# Altium schematic sheet 0071_HSIO MUXING -2.SchDoc
size 848 x 558 mm
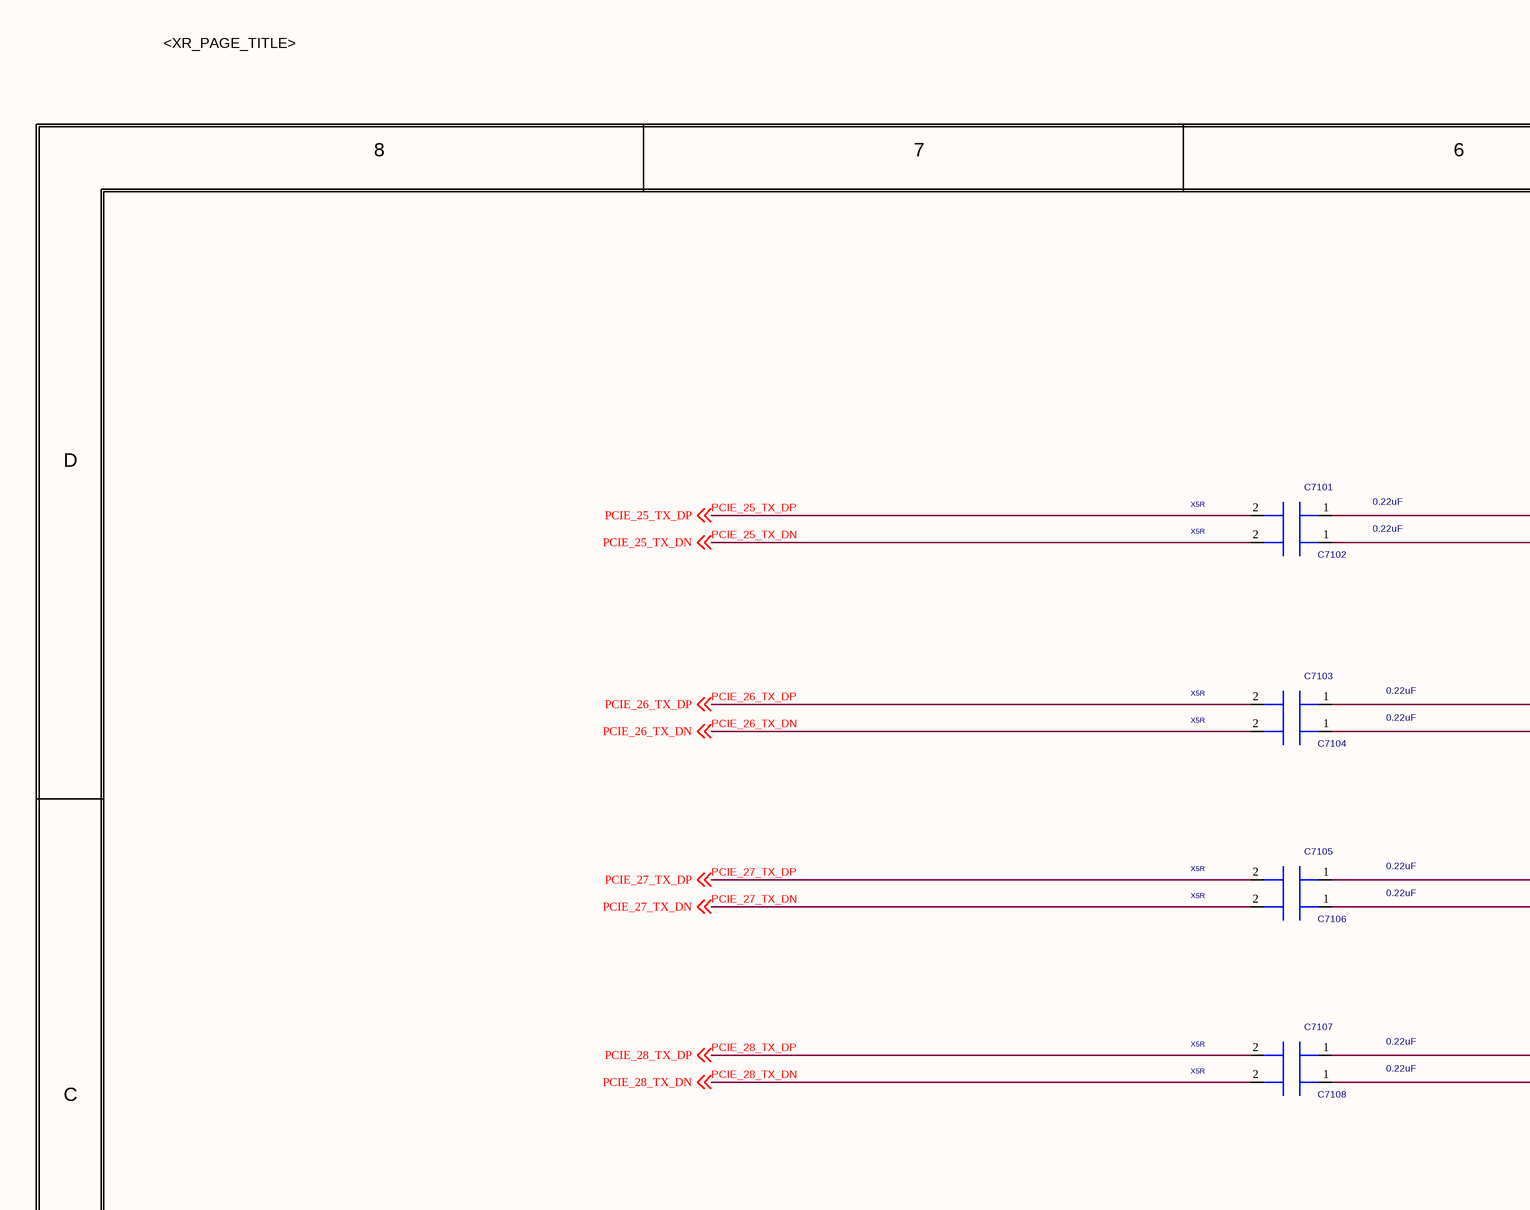
[diagram p0: 0071_HSIO MUXING -2.SchDoc, top left]
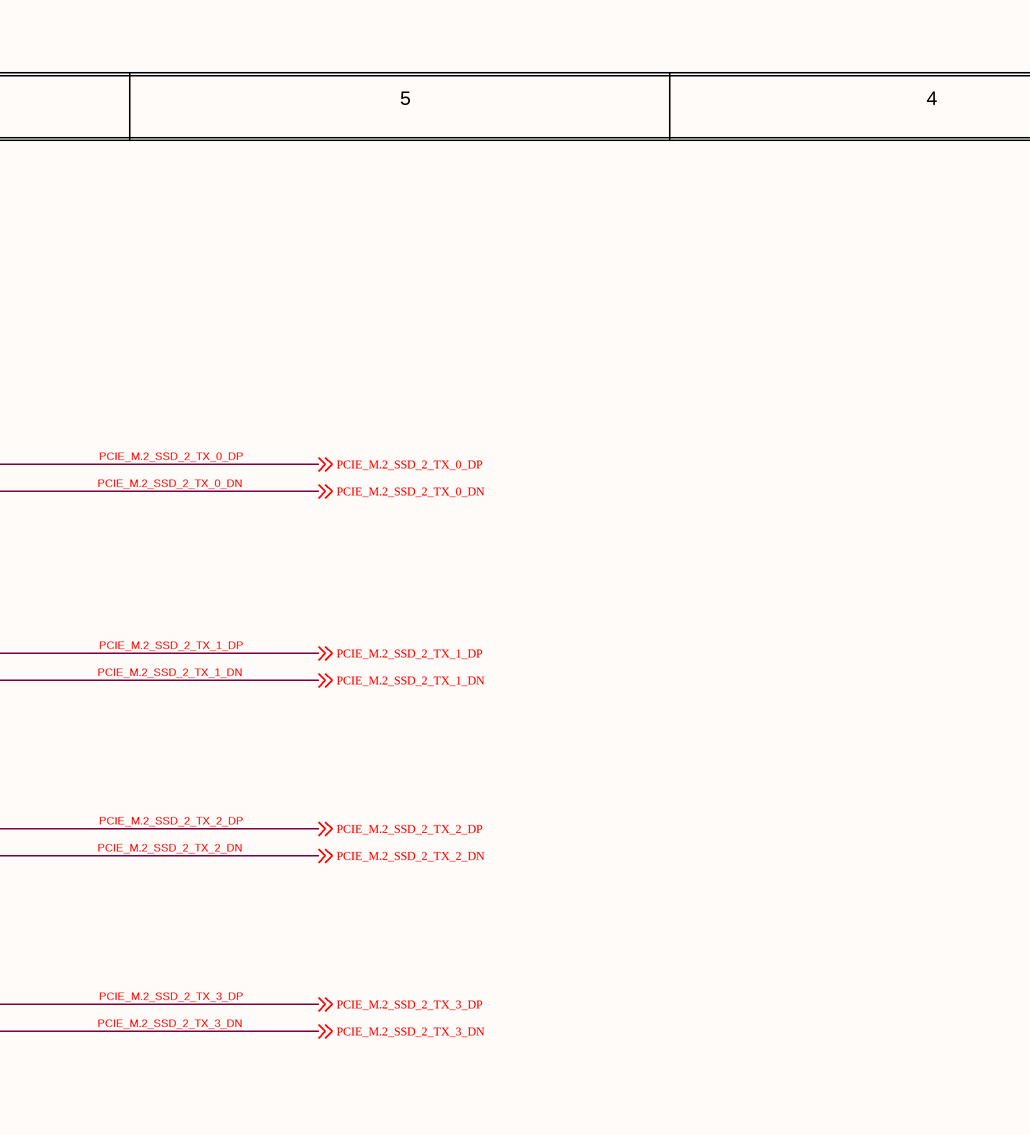
[diagram p1: 0071_HSIO MUXING -2.SchDoc, top middle]
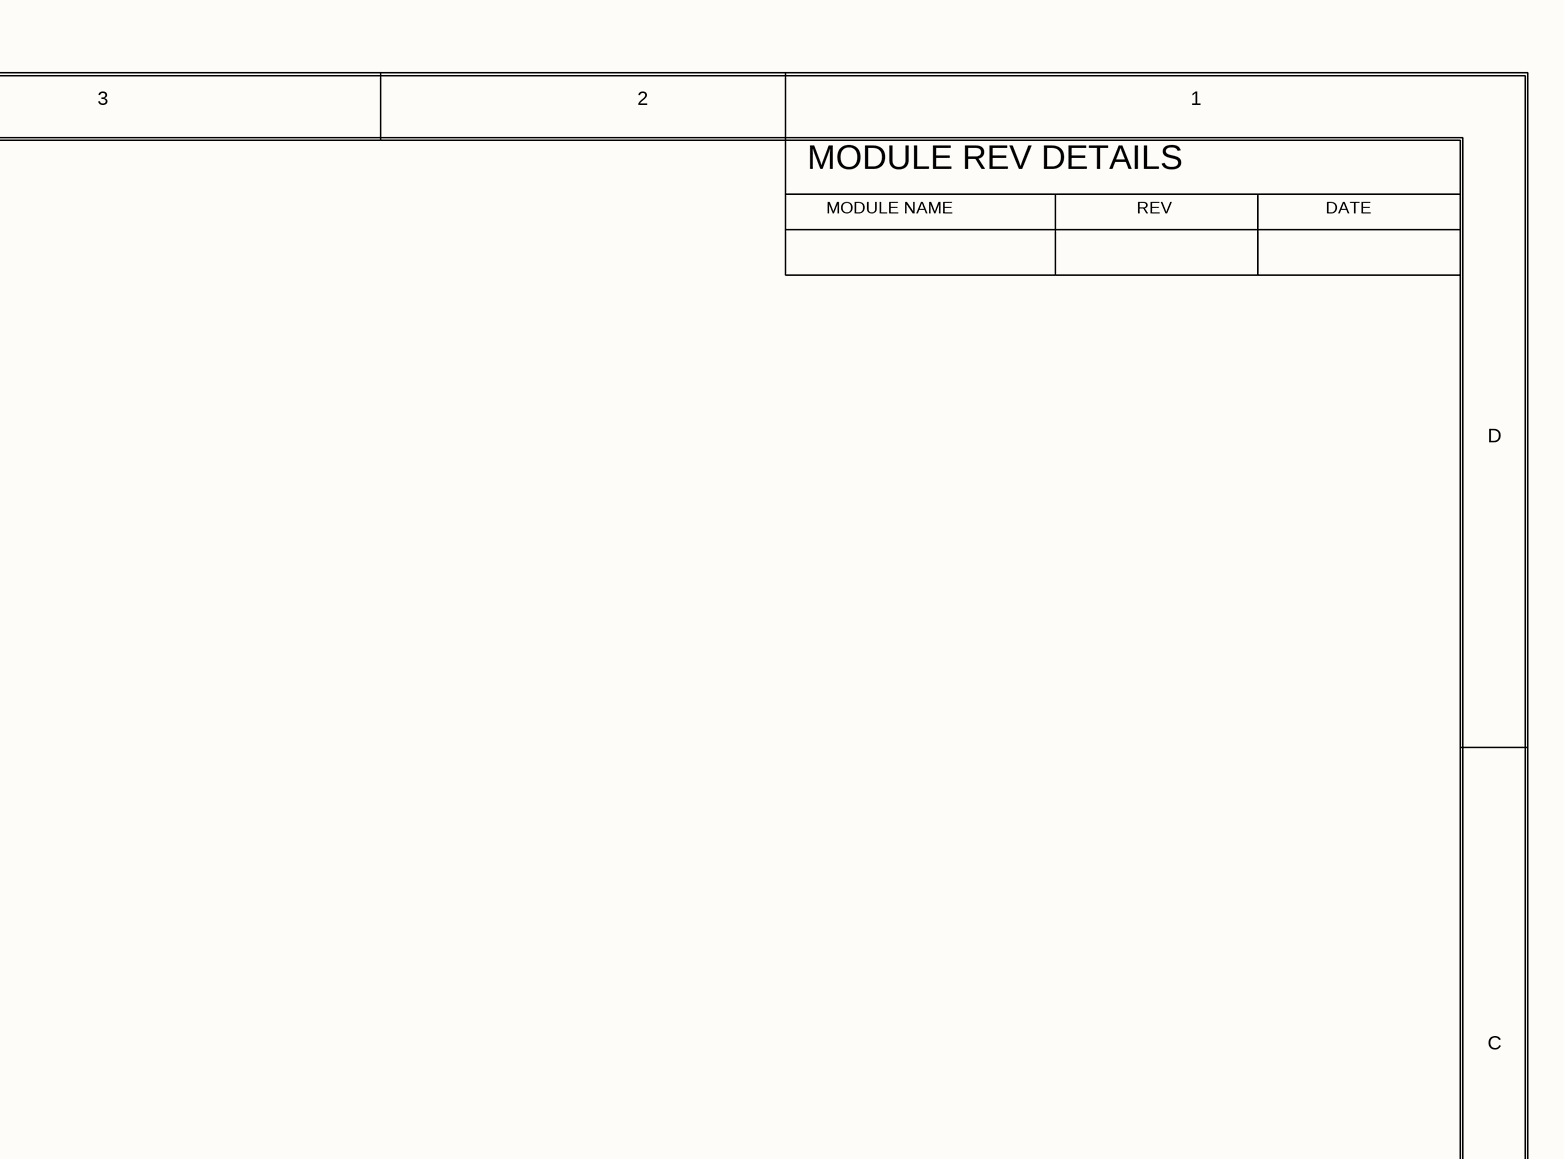
[diagram p2: 0071_HSIO MUXING -2.SchDoc, top right]
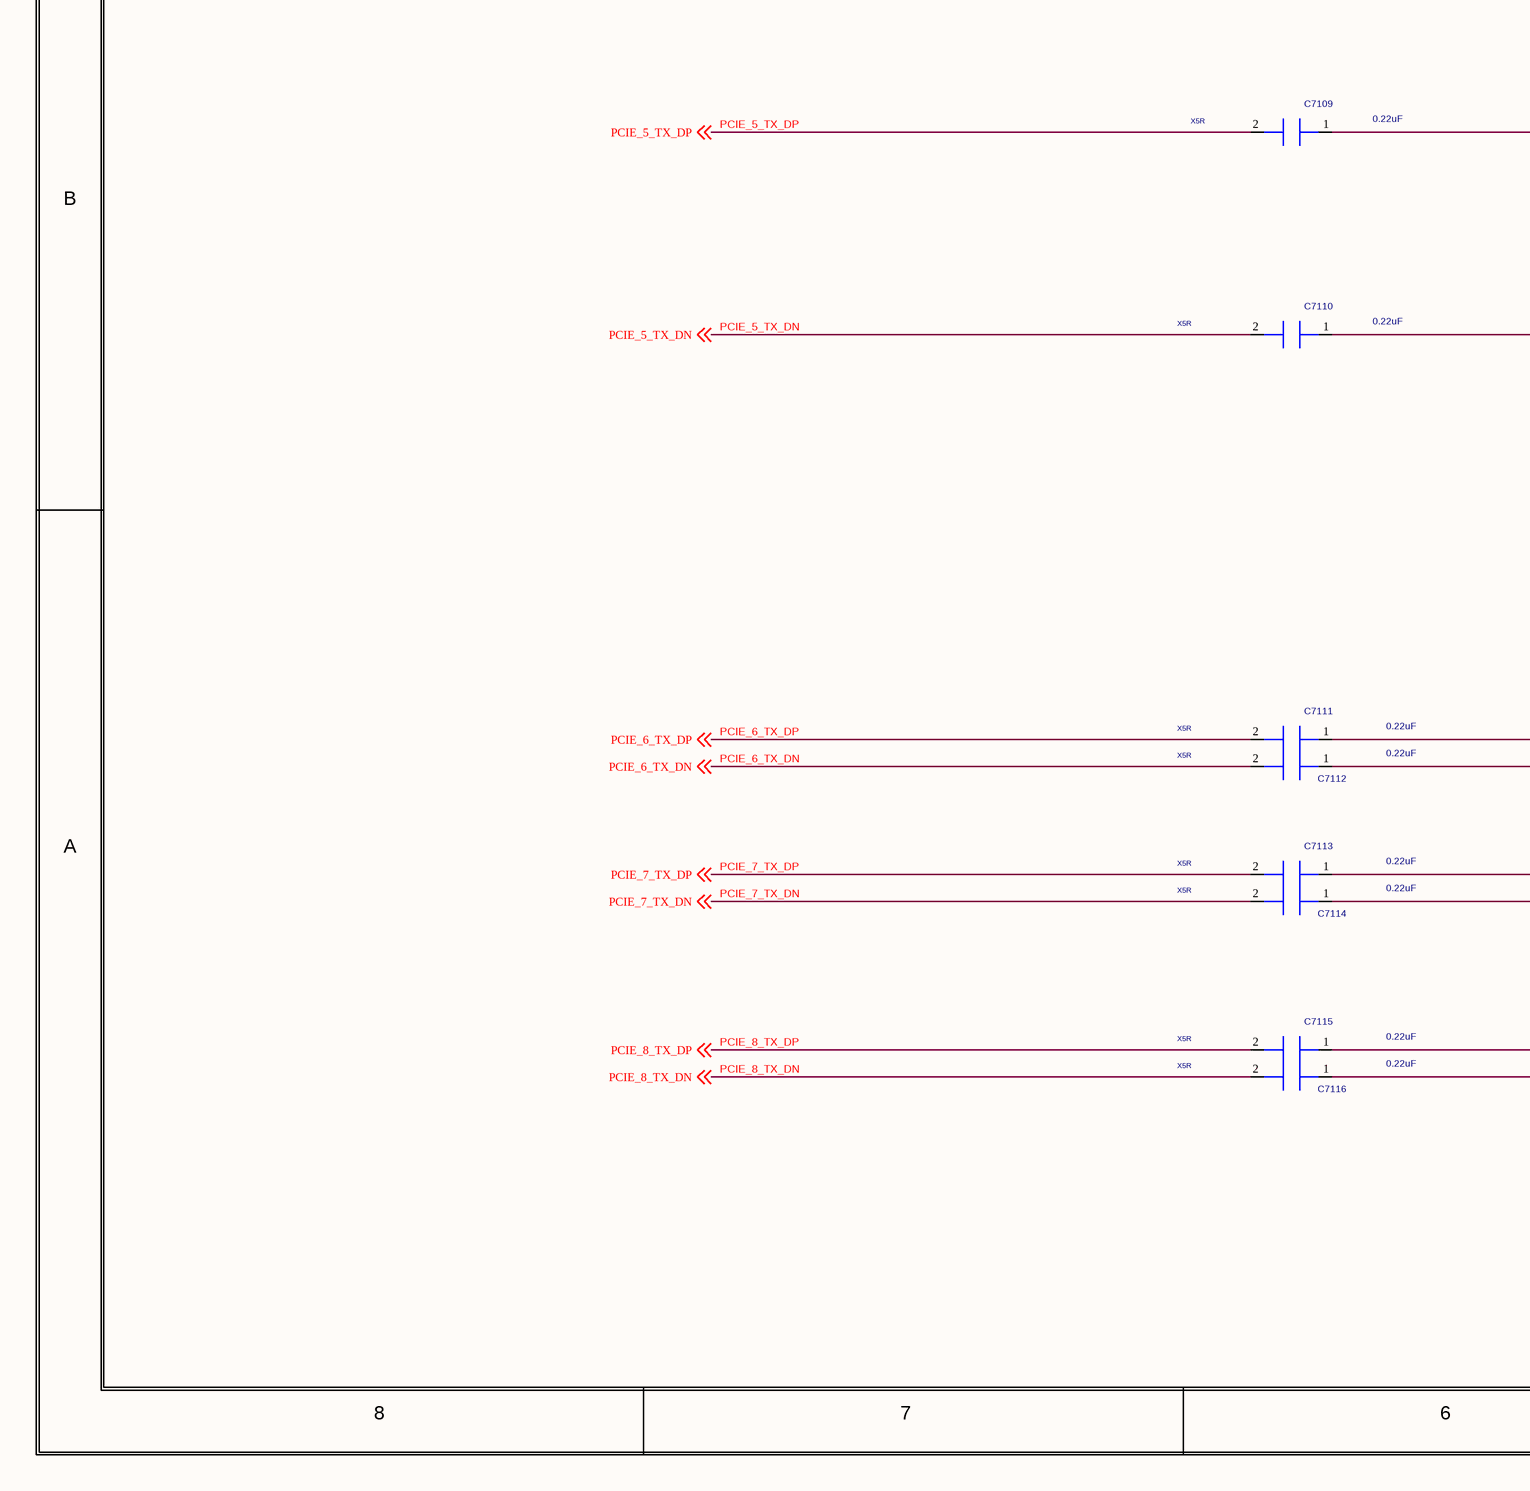
[diagram p3: 0071_HSIO MUXING -2.SchDoc, bottom left]
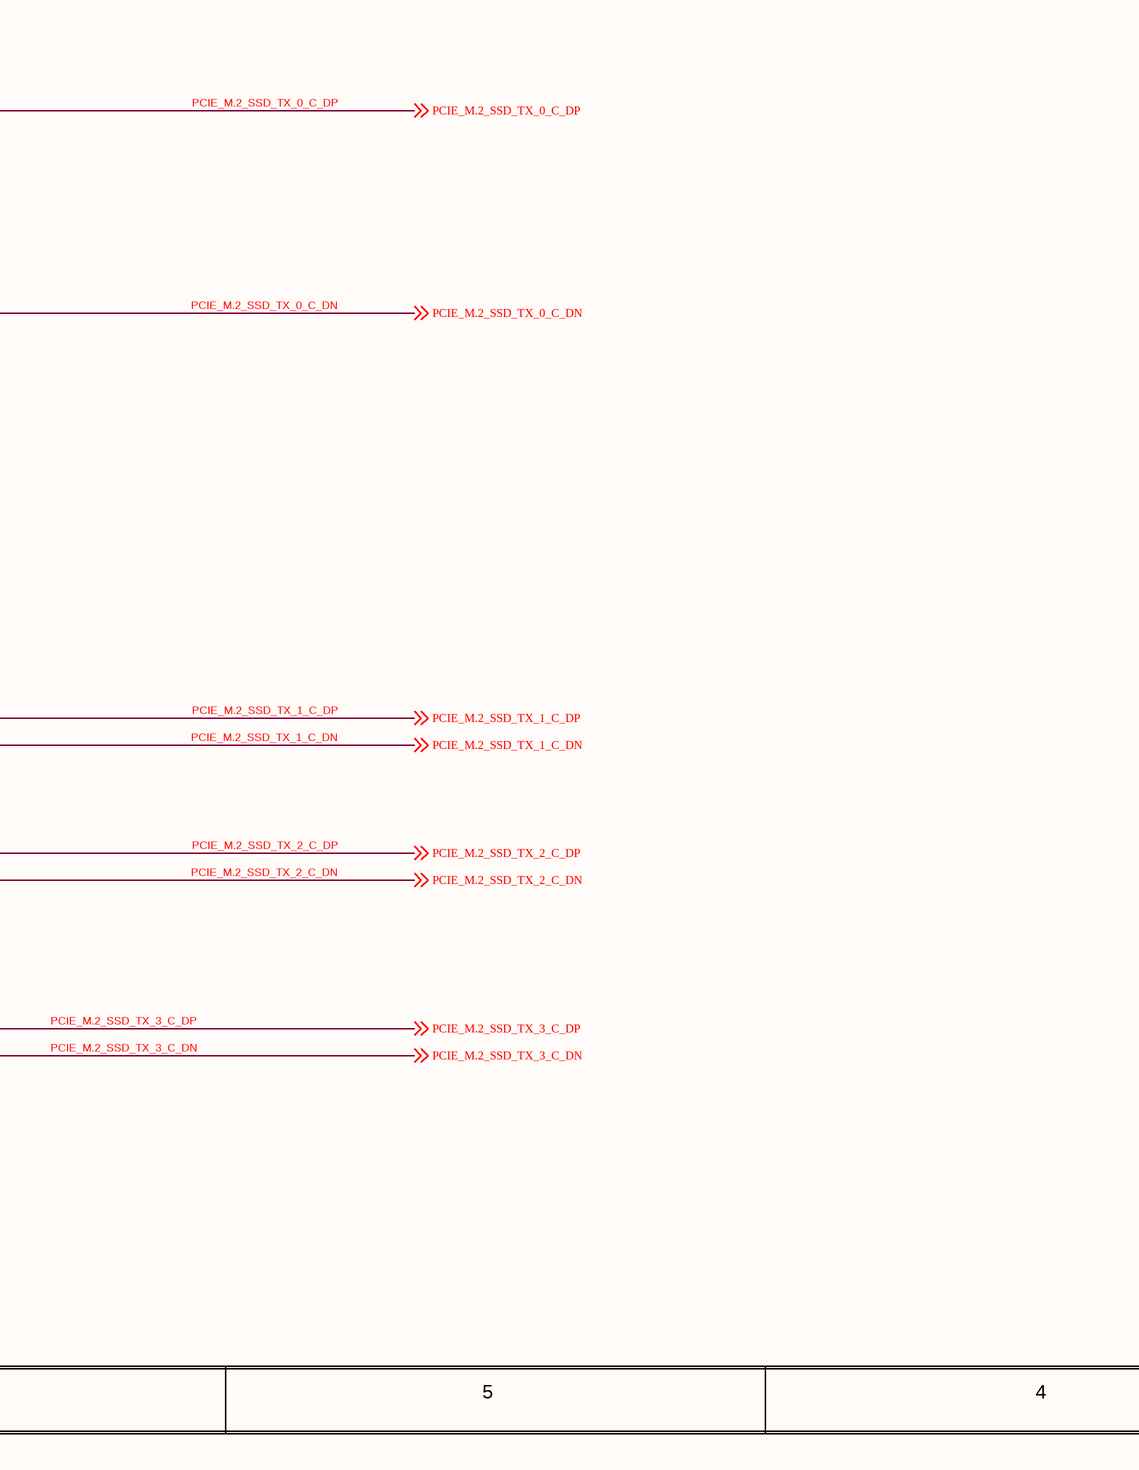
[diagram p4: 0071_HSIO MUXING -2.SchDoc, bottom middle]
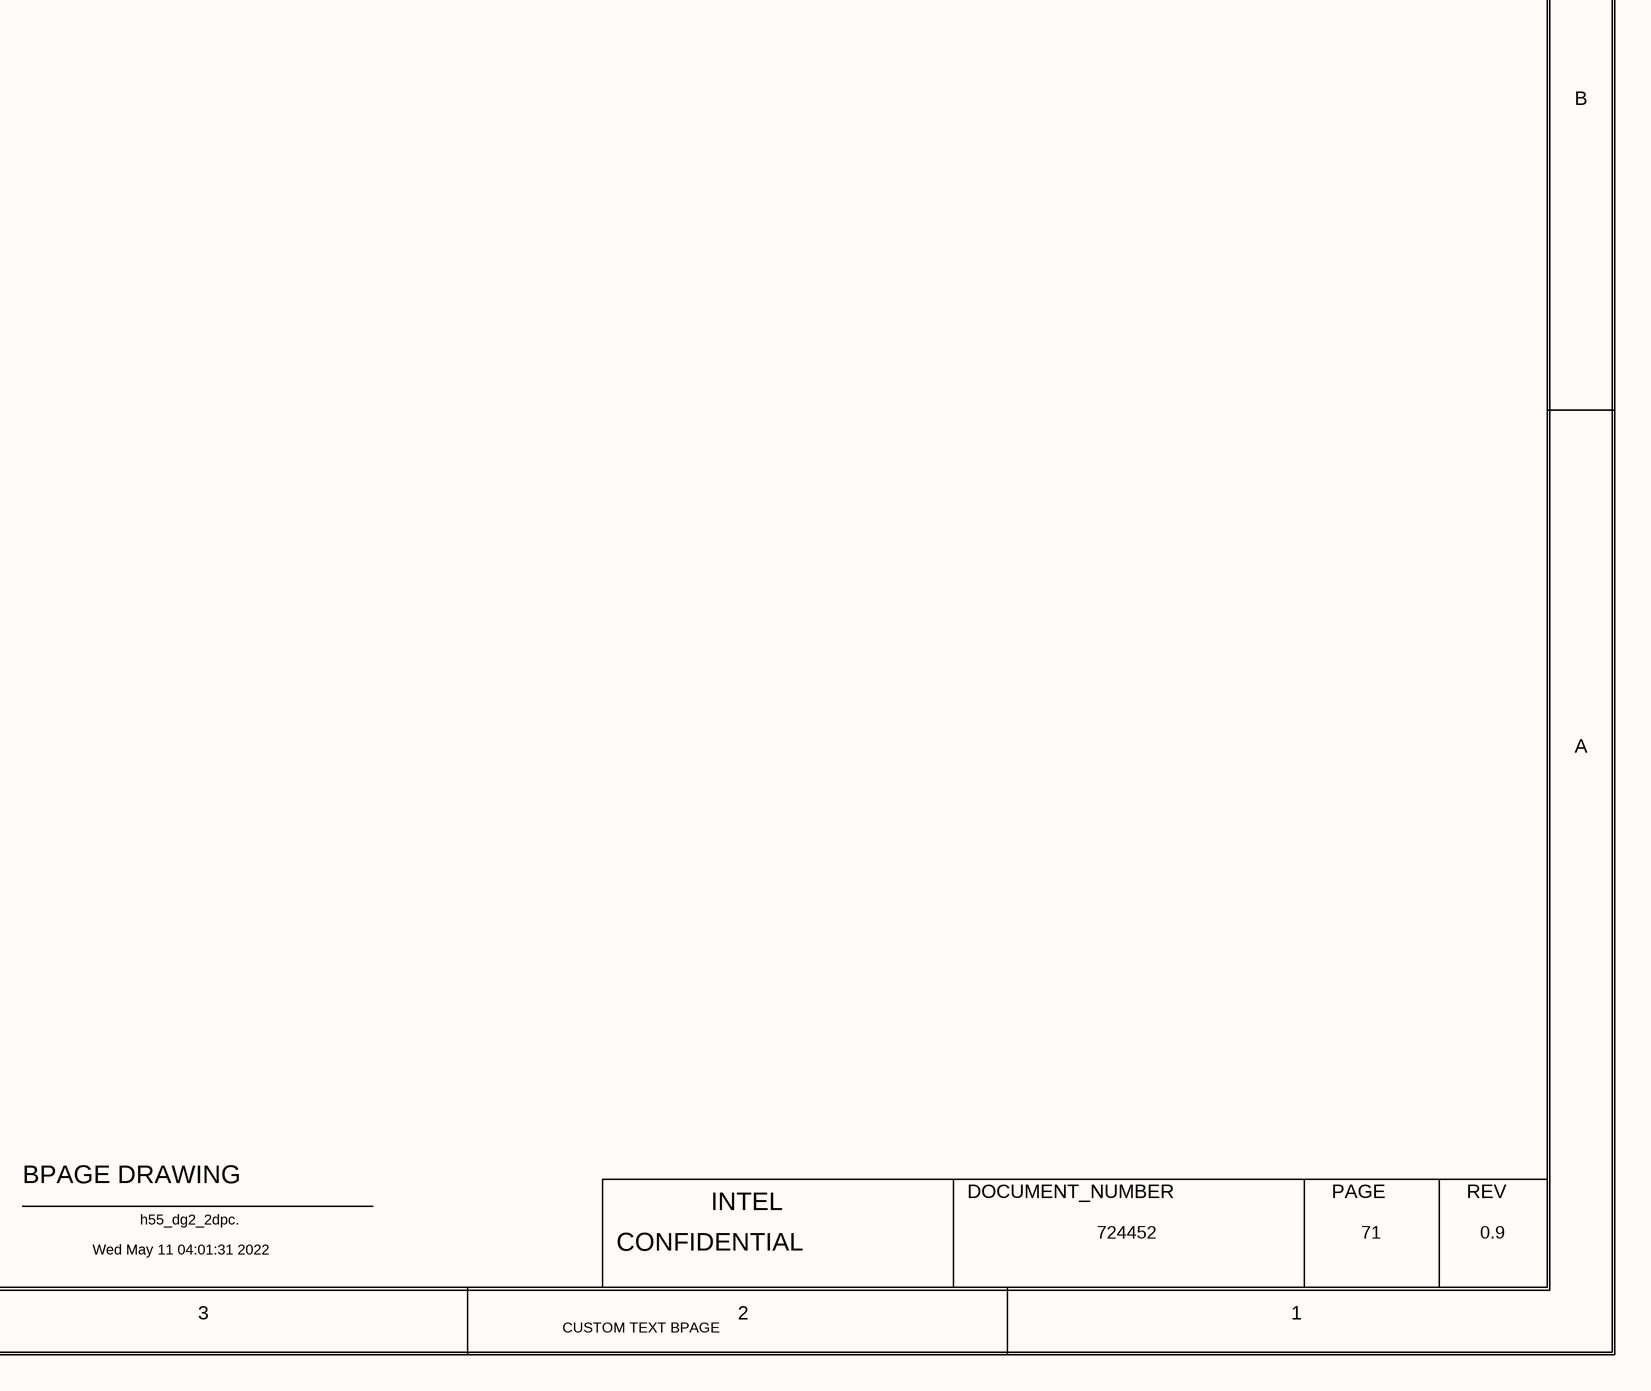
[diagram p5: 0071_HSIO MUXING -2.SchDoc, bottom right]

## Parts
C7101  0.22uF  MATERIAL: X5R  [SMC0201MB]
C7102  0.22uF  MATERIAL: X5R  [SMC0201MB]
C7103  0.22uF  MATERIAL: X5R  [SMC0201MB]
C7104  0.22uF  MATERIAL: X5R  [SMC0201MB]
C7105  0.22uF  MATERIAL: X5R  [SMC0201MB]
C7106  0.22uF  MATERIAL: X5R  [SMC0201MB]
C7107  0.22uF  MATERIAL: X5R  [SMC0201MB]
C7108  0.22uF  MATERIAL: X5R  [SMC0201MB]
C7109  0.22uF  MATERIAL: X5R  [SMC0201MB]
C7110  0.22uF  MATERIAL: X5R  [SMC0201MB]
C7111  0.22uF  MATERIAL: X5R  [SMC0201MB]
C7112  0.22uF  MATERIAL: X5R  [SMC0201MB]
C7113  0.22uF  MATERIAL: X5R  [SMC0201MB]
C7114  0.22uF  MATERIAL: X5R  [SMC0201MB]
C7115  0.22uF  MATERIAL: X5R  [SMC0201MB]
C7116  0.22uF  MATERIAL: X5R  [SMC0201MB]

## Nets
PCIE_5_TX_DN: C7110.2(B) ; off-sheet PCIE_5_TX_DN
PCIE_5_TX_DP: C7109.2(B) ; off-sheet PCIE_5_TX_DP
PCIE_6_TX_DN: C7112.2(B) ; off-sheet PCIE_6_TX_DN
PCIE_6_TX_DP: C7111.2(B) ; off-sheet PCIE_6_TX_DP
PCIE_7_TX_DN: C7114.2(B) ; off-sheet PCIE_7_TX_DN
PCIE_7_TX_DP: C7113.2(B) ; off-sheet PCIE_7_TX_DP
PCIE_8_TX_DN: C7116.2(B) ; off-sheet PCIE_8_TX_DN
PCIE_8_TX_DP: C7115.2(B) ; off-sheet PCIE_8_TX_DP
PCIE_25_TX_DN: C7102.2(B) ; off-sheet PCIE_25_TX_DN
PCIE_25_TX_DP: C7101.2(B) ; off-sheet PCIE_25_TX_DP
PCIE_26_TX_DN: C7104.2(B) ; off-sheet PCIE_26_TX_DN
PCIE_26_TX_DP: C7103.2(B) ; off-sheet PCIE_26_TX_DP
PCIE_27_TX_DN: C7106.2(B) ; off-sheet PCIE_27_TX_DN
PCIE_27_TX_DP: C7105.2(B) ; off-sheet PCIE_27_TX_DP
PCIE_28_TX_DN: C7108.2(B) ; off-sheet PCIE_28_TX_DN
PCIE_28_TX_DP: C7107.2(B) ; off-sheet PCIE_28_TX_DP
PCIE_M.2_SSD_2_TX_0_DN: C7102.1(A) ; off-sheet PCIE_M.2_SSD_2_TX_0_DN
PCIE_M.2_SSD_2_TX_0_DP: C7101.1(A) ; off-sheet PCIE_M.2_SSD_2_TX_0_DP
PCIE_M.2_SSD_2_TX_1_DN: C7104.1(A) ; off-sheet PCIE_M.2_SSD_2_TX_1_DN
PCIE_M.2_SSD_2_TX_1_DP: C7103.1(A) ; off-sheet PCIE_M.2_SSD_2_TX_1_DP
PCIE_M.2_SSD_2_TX_2_DN: C7106.1(A) ; off-sheet PCIE_M.2_SSD_2_TX_2_DN
PCIE_M.2_SSD_2_TX_2_DP: C7105.1(A) ; off-sheet PCIE_M.2_SSD_2_TX_2_DP
PCIE_M.2_SSD_2_TX_3_DN: C7108.1(A) ; off-sheet PCIE_M.2_SSD_2_TX_3_DN
PCIE_M.2_SSD_2_TX_3_DP: C7107.1(A) ; off-sheet PCIE_M.2_SSD_2_TX_3_DP
PCIE_M.2_SSD_TX_0_C_DN: C7110.1(A) ; off-sheet PCIE_M.2_SSD_TX_0_C_DN
PCIE_M.2_SSD_TX_0_C_DP: C7109.1(A) ; off-sheet PCIE_M.2_SSD_TX_0_C_DP
PCIE_M.2_SSD_TX_1_C_DN: C7112.1(A) ; off-sheet PCIE_M.2_SSD_TX_1_C_DN
PCIE_M.2_SSD_TX_1_C_DP: C7111.1(A) ; off-sheet PCIE_M.2_SSD_TX_1_C_DP
PCIE_M.2_SSD_TX_2_C_DN: C7114.1(A) ; off-sheet PCIE_M.2_SSD_TX_2_C_DN
PCIE_M.2_SSD_TX_2_C_DP: C7113.1(A) ; off-sheet PCIE_M.2_SSD_TX_2_C_DP
PCIE_M.2_SSD_TX_3_C_DN: C7116.1(A) ; off-sheet PCIE_M.2_SSD_TX_3_C_DN
PCIE_M.2_SSD_TX_3_C_DP: C7115.1(A) ; off-sheet PCIE_M.2_SSD_TX_3_C_DP

## Notes on the sheet
- <XR_PAGE_TITLE>
- 8
- 7
- 6
- 5
- 4
- 3
- 2
- 1
- MODULE REV DETAILS
- MODULE NAME
- REV
- DATE
- D
- C
- B
- A
- BPAGE DRAWING
- INTEL
- DOCUMENT_NUMBER
- PAGE
- Wed May 11 04:01:31 2022
- h55_dg2_2dpc.
- CONFIDENTIAL
- 724452
- 71
- 0.9
- CUSTOM TEXT BPAGE

## Library data of the parts
C7101 = CAP#2: PART_NUMBER: K27071-001; CHIPS_PART_NAME: CAP; CDS_PHYS_PART_NAME: CAP_0201-K27071-001,X5R,0.22UF,25V,20%,LPDB,GENERIC; PACK_TYPE: 0201; TOLERANCE: 20%; VOLTAGE: 25V; OriginalSymbolOrigin: (-75,25); XY: (-12525,7225); VER: 4; ROT: 2; PHYS_PAGE: 71; LOCATION: C7101; IP: GENERIC; FP_TECH: LPDB; DRAWING: @RVP1_ADL_SB_ADP_S_DDR5_SODIMM_2DPC_LIB.H55_DG2_2DPC(SCH_1):PAGE71; CDS_LIB: discrete; PCB Footprint: SMC0201MB; CDS_PART_NAME: CAP_0201-K27071-001,X5R,0.22UF,25V,20%,LPDB,GENERIC; CDS_LOCATION: C7101; ASI_MODEL: K27071-001
C7102 = CAP#2: PART_NUMBER: K27071-001; CHIPS_PART_NAME: CAP; CDS_PHYS_PART_NAME: CAP_0201-K27071-001,X5R,0.22UF,25V,20%,LPDB,GENERIC; PACK_TYPE: 0201; TOLERANCE: 20%; VOLTAGE: 25V; OriginalSymbolOrigin: (-75,25); XY: (-12525,7175); VER: 4; ROT: 2; PHYS_PAGE: 71; LOCATION: C7102; IP: GENERIC; FP_TECH: LPDB; DRAWING: @RVP1_ADL_SB_ADP_S_DDR5_SODIMM_2DPC_LIB.H55_DG2_2DPC(SCH_1):PAGE71; CDS_LIB: discrete; PCB Footprint: SMC0201MB; CDS_PART_NAME: CAP_0201-K27071-001,X5R,0.22UF,25V,20%,LPDB,GENERIC; CDS_LOCATION: C7102; ASI_MODEL: K27071-001
C7103 = CAP#2: PART_NUMBER: K27071-001; CHIPS_PART_NAME: CAP; CDS_PHYS_PART_NAME: CAP_0201-K27071-001,X5R,0.22UF,25V,20%,LPDB,GENERIC; PACK_TYPE: 0201; TOLERANCE: 20%; VOLTAGE: 25V; OriginalSymbolOrigin: (-75,25); XY: (-12525,6875); VER: 4; ROT: 2; PHYS_PAGE: 71; LOCATION: C7103; IP: GENERIC; FP_TECH: LPDB; DRAWING: @RVP1_ADL_SB_ADP_S_DDR5_SODIMM_2DPC_LIB.H55_DG2_2DPC(SCH_1):PAGE71; CDS_LIB: discrete; PCB Footprint: SMC0201MB; CDS_PART_NAME: CAP_0201-K27071-001,X5R,0.22UF,25V,20%,LPDB,GENERIC; CDS_LOCATION: C7103; ASI_MODEL: K27071-001
C7104 = CAP#2: PART_NUMBER: K27071-001; CHIPS_PART_NAME: CAP; CDS_PHYS_PART_NAME: CAP_0201-K27071-001,X5R,0.22UF,25V,20%,LPDB,GENERIC; PACK_TYPE: 0201; TOLERANCE: 20%; VOLTAGE: 25V; OriginalSymbolOrigin: (-75,25); XY: (-12525,6825); VER: 4; ROT: 2; PHYS_PAGE: 71; LOCATION: C7104; IP: GENERIC; FP_TECH: LPDB; DRAWING: @RVP1_ADL_SB_ADP_S_DDR5_SODIMM_2DPC_LIB.H55_DG2_2DPC(SCH_1):PAGE71; CDS_LIB: discrete; PCB Footprint: SMC0201MB; CDS_PART_NAME: CAP_0201-K27071-001,X5R,0.22UF,25V,20%,LPDB,GENERIC; CDS_LOCATION: C7104; ASI_MODEL: K27071-001
C7105 = CAP#2: PART_NUMBER: K27071-001; CHIPS_PART_NAME: CAP; CDS_PHYS_PART_NAME: CAP_0201-K27071-001,X5R,0.22UF,25V,20%,LPDB,GENERIC; PACK_TYPE: 0201; TOLERANCE: 20%; VOLTAGE: 25V; OriginalSymbolOrigin: (-75,25); XY: (-12525,6550); VER: 4; ROT: 2; PHYS_PAGE: 71; LOCATION: C7105; IP: GENERIC; FP_TECH: LPDB; DRAWING: @RVP1_ADL_SB_ADP_S_DDR5_SODIMM_2DPC_LIB.H55_DG2_2DPC(SCH_1):PAGE71; CDS_LIB: discrete; PCB Footprint: SMC0201MB; CDS_PART_NAME: CAP_0201-K27071-001,X5R,0.22UF,25V,20%,LPDB,GENERIC; CDS_LOCATION: C7105; ASI_MODEL: K27071-001
C7106 = CAP#2: PART_NUMBER: K27071-001; CHIPS_PART_NAME: CAP; CDS_PHYS_PART_NAME: CAP_0201-K27071-001,X5R,0.22UF,25V,20%,LPDB,GENERIC; PACK_TYPE: 0201; TOLERANCE: 20%; VOLTAGE: 25V; OriginalSymbolOrigin: (-75,25); XY: (-12525,6500); VER: 4; ROT: 2; PHYS_PAGE: 71; LOCATION: C7106; IP: GENERIC; FP_TECH: LPDB; DRAWING: @RVP1_ADL_SB_ADP_S_DDR5_SODIMM_2DPC_LIB.H55_DG2_2DPC(SCH_1):PAGE71; CDS_LIB: discrete; PCB Footprint: SMC0201MB; CDS_PART_NAME: CAP_0201-K27071-001,X5R,0.22UF,25V,20%,LPDB,GENERIC; CDS_LOCATION: C7106; ASI_MODEL: K27071-001
C7107 = CAP#2: PART_NUMBER: K27071-001; CHIPS_PART_NAME: CAP; CDS_PHYS_PART_NAME: CAP_0201-K27071-001,X5R,0.22UF,25V,20%,LPDB,GENERIC; PACK_TYPE: 0201; TOLERANCE: 20%; VOLTAGE: 25V; OriginalSymbolOrigin: (-75,25); XY: (-12525,6225); VER: 4; ROT: 2; PHYS_PAGE: 71; LOCATION: C7107; IP: GENERIC; FP_TECH: LPDB; DRAWING: @RVP1_ADL_SB_ADP_S_DDR5_SODIMM_2DPC_LIB.H55_DG2_2DPC(SCH_1):PAGE71; CDS_LIB: discrete; PCB Footprint: SMC0201MB; CDS_PART_NAME: CAP_0201-K27071-001,X5R,0.22UF,25V,20%,LPDB,GENERIC; CDS_LOCATION: C7107; ASI_MODEL: K27071-001
C7108 = CAP#2: PART_NUMBER: K27071-001; CHIPS_PART_NAME: CAP; CDS_PHYS_PART_NAME: CAP_0201-K27071-001,X5R,0.22UF,25V,20%,LPDB,GENERIC; PACK_TYPE: 0201; TOLERANCE: 20%; VOLTAGE: 25V; OriginalSymbolOrigin: (-75,25); XY: (-12525,6175); VER: 4; ROT: 2; PHYS_PAGE: 71; LOCATION: C7108; IP: GENERIC; FP_TECH: LPDB; DRAWING: @RVP1_ADL_SB_ADP_S_DDR5_SODIMM_2DPC_LIB.H55_DG2_2DPC(SCH_1):PAGE71; CDS_LIB: discrete; PCB Footprint: SMC0201MB; CDS_PART_NAME: CAP_0201-K27071-001,X5R,0.22UF,25V,20%,LPDB,GENERIC; CDS_LOCATION: C7108; ASI_MODEL: K27071-001
C7109 = CAP#2: PART_NUMBER: K27071-001; CHIPS_PART_NAME: CAP; CDS_PHYS_PART_NAME: CAP_0201-K27071-001,X5R,0.22UF,25V,20%,LPDB,GENERIC; PACK_TYPE: 0201; TOLERANCE: 20%; VOLTAGE: 25V; OriginalSymbolOrigin: (-75,25); XY: (-12525,5150); VER: 4; ROT: 2; PHYS_PAGE: 71; LOCATION: C7109; IP: GENERIC; FP_TECH: LPDB; DRAWING: @RVP1_ADL_SB_ADP_S_DDR5_SODIMM_2DPC_LIB.H55_DG2_2DPC(SCH_1):PAGE71; CDS_LIB: discrete; PCB Footprint: SMC0201MB; CDS_PART_NAME: CAP_0201-K27071-001,X5R,0.22UF,25V,20%,LPDB,GENERIC; CDS_LOCATION: C7109; ASI_MODEL: K27071-001
C7110 = CAP#2: PART_NUMBER: K27071-001; CHIPS_PART_NAME: CAP; CDS_PHYS_PART_NAME: CAP_0201-K27071-001,X5R,0.22UF,25V,20%,LPDB,GENERIC; PACK_TYPE: 0201; TOLERANCE: 20%; VOLTAGE: 25V; OriginalSymbolOrigin: (-75,25); XY: (-12525,4775); VER: 4; ROT: 2; PHYS_PAGE: 71; LOCATION: C7110; IP: GENERIC; FP_TECH: LPDB; DRAWING: @RVP1_ADL_SB_ADP_S_DDR5_SODIMM_2DPC_LIB.H55_DG2_2DPC(SCH_1):PAGE71; CDS_LIB: discrete; PCB Footprint: SMC0201MB; CDS_PART_NAME: CAP_0201-K27071-001,X5R,0.22UF,25V,20%,LPDB,GENERIC; CDS_LOCATION: C7110; ASI_MODEL: K27071-001
C7111 = CAP#2: PART_NUMBER: K27071-001; CHIPS_PART_NAME: CAP; CDS_PHYS_PART_NAME: CAP_0201-K27071-001,X5R,0.22UF,25V,20%,LPDB,GENERIC; PACK_TYPE: 0201; TOLERANCE: 20%; VOLTAGE: 25V; OriginalSymbolOrigin: (-75,25); XY: (-12525,4025); VER: 4; ROT: 2; PHYS_PAGE: 71; LOCATION: C7111; IP: GENERIC; FP_TECH: LPDB; DRAWING: @RVP1_ADL_SB_ADP_S_DDR5_SODIMM_2DPC_LIB.H55_DG2_2DPC(SCH_1):PAGE71; CDS_LIB: discrete; PCB Footprint: SMC0201MB; CDS_PART_NAME: CAP_0201-K27071-001,X5R,0.22UF,25V,20%,LPDB,GENERIC; CDS_LOCATION: C7111; ASI_MODEL: K27071-001
C7112 = CAP#2: PART_NUMBER: K27071-001; CHIPS_PART_NAME: CAP; CDS_PHYS_PART_NAME: CAP_0201-K27071-001,X5R,0.22UF,25V,20%,LPDB,GENERIC; PACK_TYPE: 0201; TOLERANCE: 20%; VOLTAGE: 25V; OriginalSymbolOrigin: (-75,25); XY: (-12525,3975); VER: 4; ROT: 2; PHYS_PAGE: 71; LOCATION: C7112; IP: GENERIC; FP_TECH: LPDB; DRAWING: @RVP1_ADL_SB_ADP_S_DDR5_SODIMM_2DPC_LIB.H55_DG2_2DPC(SCH_1):PAGE71; CDS_LIB: discrete; PCB Footprint: SMC0201MB; CDS_PART_NAME: CAP_0201-K27071-001,X5R,0.22UF,25V,20%,LPDB,GENERIC; CDS_LOCATION: C7112; ASI_MODEL: K27071-001
C7113 = CAP#2: PART_NUMBER: K27071-001; CHIPS_PART_NAME: CAP; CDS_PHYS_PART_NAME: CAP_0201-K27071-001,X5R,0.22UF,25V,20%,LPDB,GENERIC; PACK_TYPE: 0201; TOLERANCE: 20%; VOLTAGE: 25V; OriginalSymbolOrigin: (-75,25); XY: (-12525,3775); VER: 4; ROT: 2; PHYS_PAGE: 71; LOCATION: C7113; IP: GENERIC; FP_TECH: LPDB; DRAWING: @RVP1_ADL_SB_ADP_S_DDR5_SODIMM_2DPC_LIB.H55_DG2_2DPC(SCH_1):PAGE71; CDS_LIB: discrete; PCB Footprint: SMC0201MB; CDS_PART_NAME: CAP_0201-K27071-001,X5R,0.22UF,25V,20%,LPDB,GENERIC; CDS_LOCATION: C7113; ASI_MODEL: K27071-001
C7114 = CAP#2: PART_NUMBER: K27071-001; CHIPS_PART_NAME: CAP; CDS_PHYS_PART_NAME: CAP_0201-K27071-001,X5R,0.22UF,25V,20%,LPDB,GENERIC; PACK_TYPE: 0201; TOLERANCE: 20%; VOLTAGE: 25V; OriginalSymbolOrigin: (-75,25); XY: (-12525,3725); VER: 4; ROT: 2; PHYS_PAGE: 71; LOCATION: C7114; IP: GENERIC; FP_TECH: LPDB; DRAWING: @RVP1_ADL_SB_ADP_S_DDR5_SODIMM_2DPC_LIB.H55_DG2_2DPC(SCH_1):PAGE71; CDS_LIB: discrete; PCB Footprint: SMC0201MB; CDS_PART_NAME: CAP_0201-K27071-001,X5R,0.22UF,25V,20%,LPDB,GENERIC; CDS_LOCATION: C7114; ASI_MODEL: K27071-001
C7115 = CAP#2: PART_NUMBER: K27071-001; CHIPS_PART_NAME: CAP; CDS_PHYS_PART_NAME: CAP_0201-K27071-001,X5R,0.22UF,25V,20%,LPDB,GENERIC; PACK_TYPE: 0201; TOLERANCE: 20%; VOLTAGE: 25V; OriginalSymbolOrigin: (-75,25); XY: (-12525,3450); VER: 4; ROT: 2; PHYS_PAGE: 71; LOCATION: C7115; IP: GENERIC; FP_TECH: LPDB; DRAWING: @RVP1_ADL_SB_ADP_S_DDR5_SODIMM_2DPC_LIB.H55_DG2_2DPC(SCH_1):PAGE71; CDS_LIB: discrete; PCB Footprint: SMC0201MB; CDS_PART_NAME: CAP_0201-K27071-001,X5R,0.22UF,25V,20%,LPDB,GENERIC; CDS_LOCATION: C7115; ASI_MODEL: K27071-001
C7116 = CAP#2: PART_NUMBER: K27071-001; CHIPS_PART_NAME: CAP; CDS_PHYS_PART_NAME: CAP_0201-K27071-001,X5R,0.22UF,25V,20%,LPDB,GENERIC; PACK_TYPE: 0201; TOLERANCE: 20%; VOLTAGE: 25V; OriginalSymbolOrigin: (-75,25); XY: (-12525,3400); VER: 4; ROT: 2; PHYS_PAGE: 71; LOCATION: C7116; IP: GENERIC; FP_TECH: LPDB; DRAWING: @RVP1_ADL_SB_ADP_S_DDR5_SODIMM_2DPC_LIB.H55_DG2_2DPC(SCH_1):PAGE71; CDS_LIB: discrete; PCB Footprint: SMC0201MB; CDS_PART_NAME: CAP_0201-K27071-001,X5R,0.22UF,25V,20%,LPDB,GENERIC; CDS_LOCATION: C7116; ASI_MODEL: K27071-001